# EAGLE design relays_board_v1_0 (EAGLE 6.4)
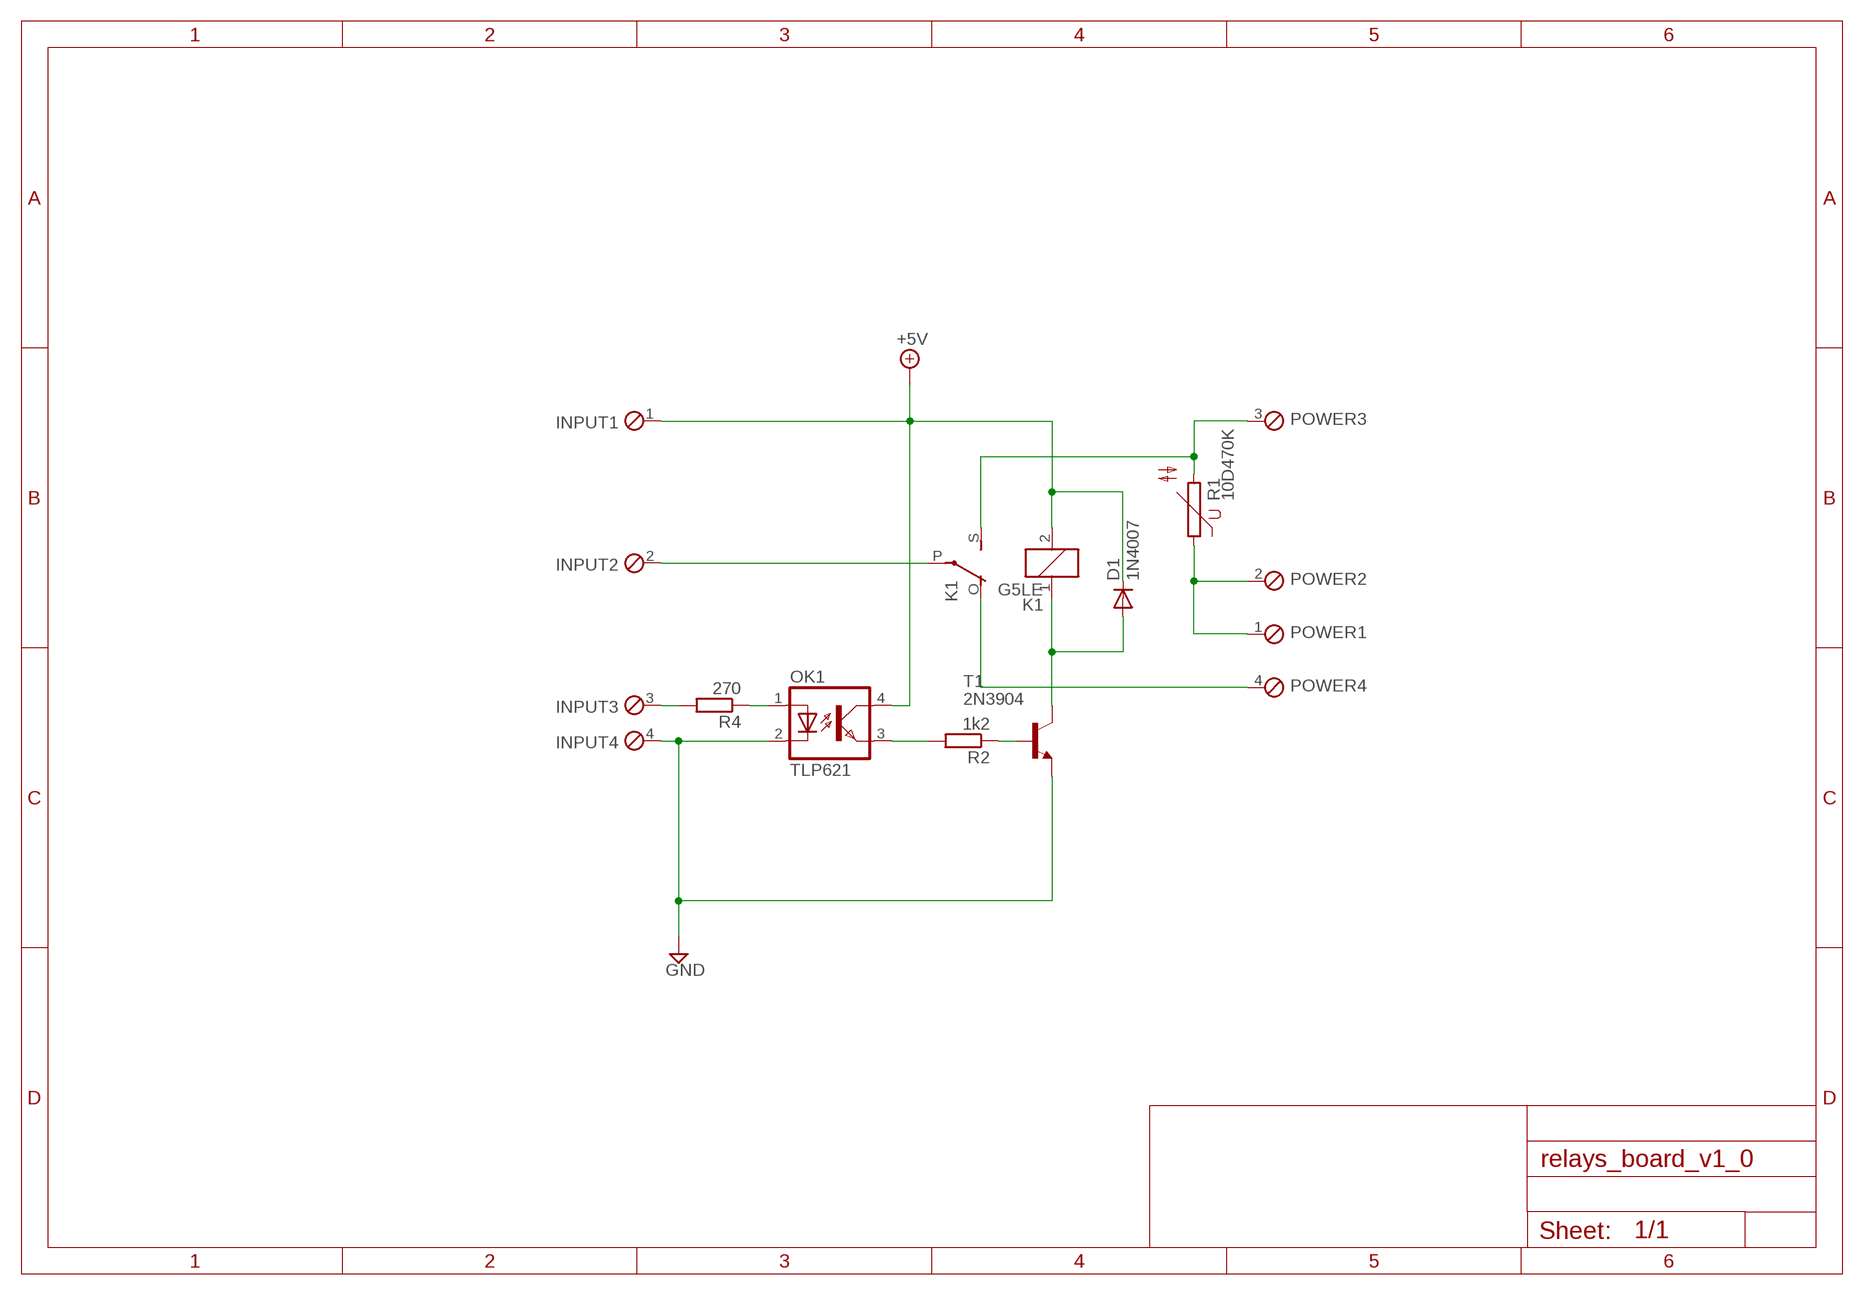
[diagram p0: schematic, sheet 1]

## Parts
D1  1N4007  [DO41-10]
INPUT  OSTTA040161  [040161]
K1  G5LE  [G5LE]
OK1  TLP621  [DIL04]
POWER  OSTTA040161  [040161]
R1  10D470K  [10D470K]
R2  1k2  R-EU_0204/7  [0204/7]
R4  270  R-EU_0204/7  [0204/7]
T1  2N3904  [TO92]

## Nets
+5V: D1.C INPUT.1 K1.2 OK1.4(COL)
GND: INPUT.4 OK1.2(C) T1.3(E)
N$1: K1.O(2:O) POWER.4
N$2: K1.S(2:S) POWER.3 R1.2
N$3: POWER.1 POWER.2 R1.1
N$4: INPUT.2 K1.P(2:P)
N$5: D1.A K1.1 T1.1(C)
N$6: INPUT.3 R4.2
N$7: OK1.1(A) R4.1
N$9: R2.1 T1.2(B)
N$10: OK1.3(EMIT) R2.2

## Library data of the parts
D1 = alex:1N4007: DIODE general purpose rectifier, 1 A
INPUT POWER = alex:OSTTA040161: OSTTA040161 4-pol Reihenklemme (Schraub) 5mm
K1 = relay:G5LE: RELAY 1 x switch, 10 A/120 V AC, 8 A/30 V DC, Omron; OC_FARNELL: unknown; OC_NEWARK: unknown
OK1 = alex:TLP621: TEXAS INSTRUMENTS OPTO COUPLER; OC_FARNELL: 1683363; OC_NEWARK: unknown
R1 = alex:10D470K: VARISTOR
R2 R4 = rcl:R-EU_: RESISTOR, European symbol
T1 = transistor:2N3904: NPN TRANSISTOR

## Board
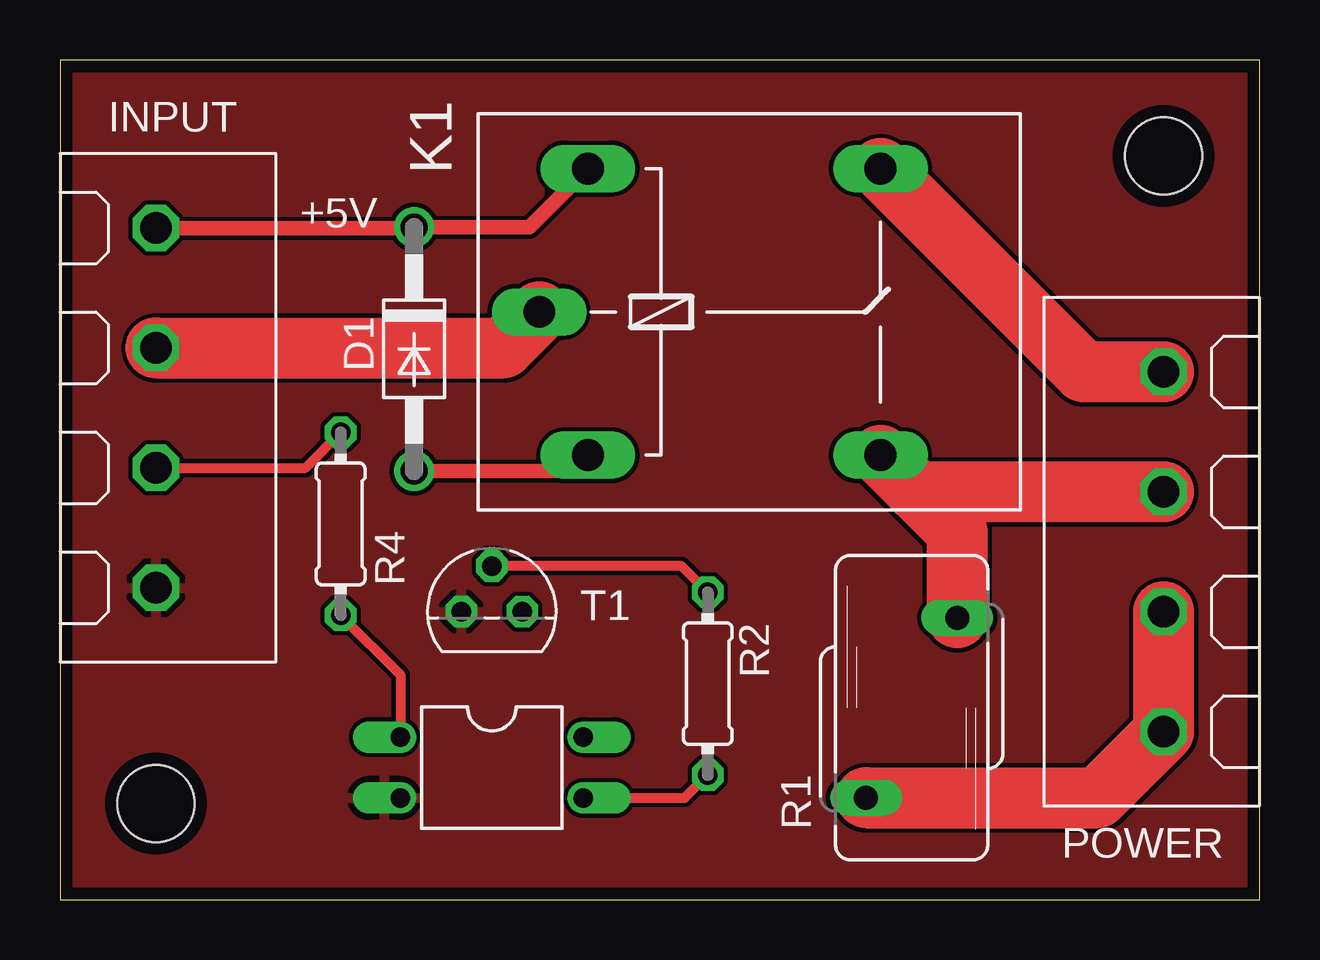
[diagram p1: board, top side]
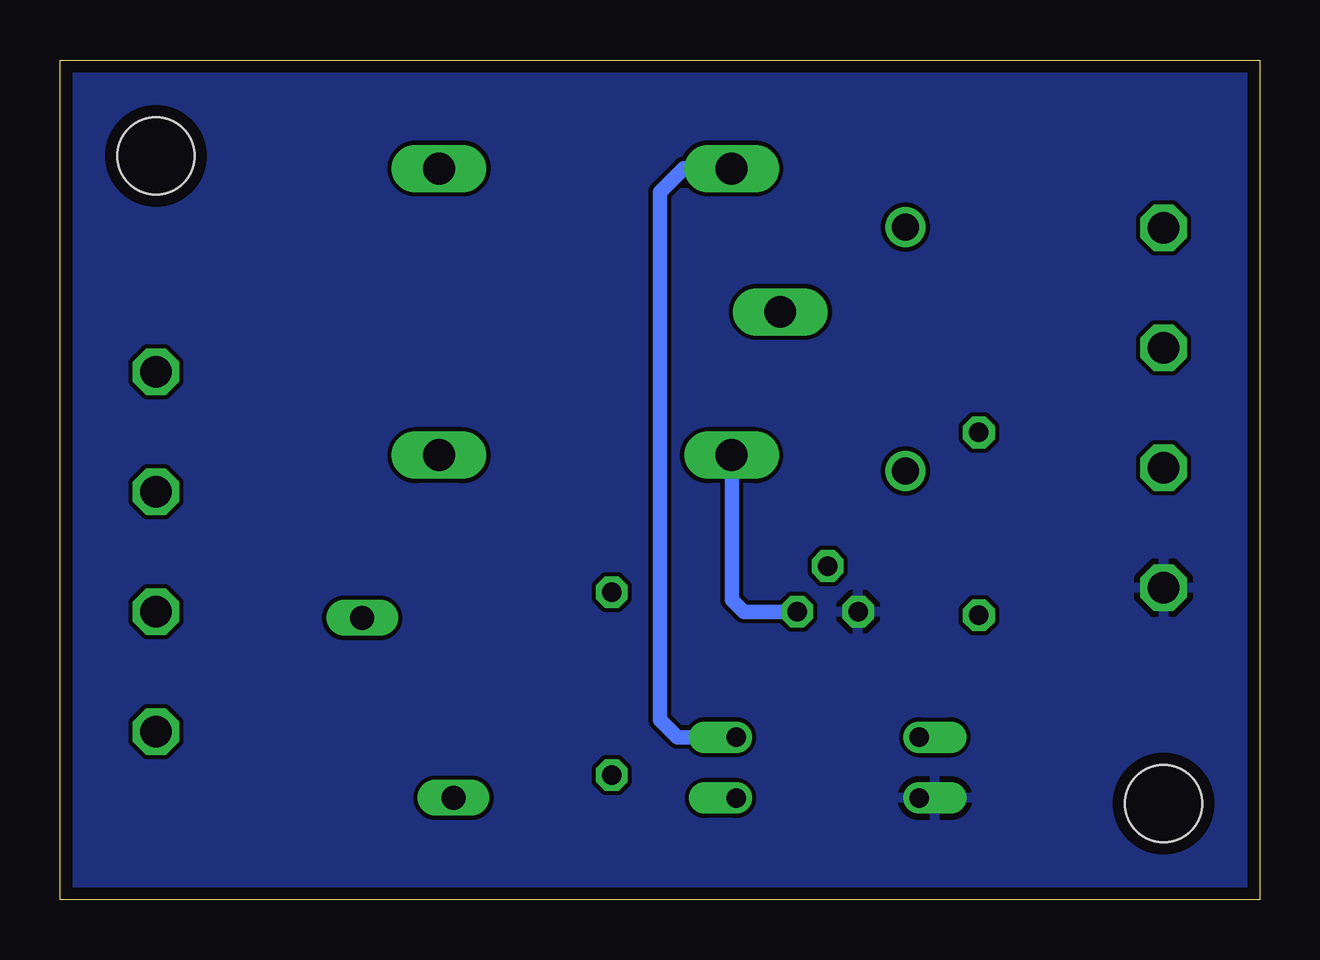
[diagram p2: board, bottom side, seen from below]

Size 50 x 35 mm. Coordinates in mm from the lower left corner, seen from the top.
Outline: 0,0 50,0 50,35 0,35 0,0
Copper layers (1*16): Top 0.035mm / dielectric 1.5mm / Bottom 0.035mm
Design rules "ShenZhen2U EagleRules": minimum track width 7mil, minimum drill 12mil, track to track 7mil, track to pad 7mil, pad to pad 7mil, via to via 7mil, smd to smd 0mil, copper to edge 20mil, drill to drill 10mil, minimum pad ring 10mil, minimum via ring 6mil, stop-mask expansion 2mil, vias tented up to drill 25mil, thermal gap 10mil
Holes 3.2 mm at 46,31 4,4

### Footprints (pad centres in the part's own frame; a part is rotated, then mirrored left to right if it is on the bottom)
DO41-10 = drill 1.118: A 5.08,0; C -5.08,0
040161 = drill 1.3 octagon: 1 -7.5,0; 2 -2.5,0; 3 2.5,0; 4 7.5,0
G5LE = drill 1.321 long: 1 -7.493,-5.969; 2 -7.493,5.969; O 4.699,5.969; P -9.525,0; S 4.699,-5.969
DIL04 = drill 0.813 offset: 1 -1.27,-3.81; 2 1.27,-3.81; 3 1.27,3.81; 4 -1.27,3.81
10D470K = drill 1 long: 1 -1.9,-3.75; 2 1.9,3.75
0204/7 = drill 0.813 octagon: 1 -3.81,0; 2 3.81,0
TO92 = drill 0.813 octagon: 1 1.27,0; 2 0,1.905; 3 -1.27,0

### Placement (x,y rotation side)
D1  14.76,22.95 270 top
INPUT  4,20.5 270 top
K1  29.5,24.5 0 top
OK1  18,5.5 270 top
POWER  46,14.5 90 top
R1  35.5,8 0 top
R2  27,9 270 top
R4  11.7,15.66 90 top
T1  18,12 0 top

### Tracks (layer width: path | path; a pad name or v marks a point on that pad's centre or on a via)
+5V
  Top 0.61: K1.2 19.57,28.03 D1.C 14.73,28 INPUT.1
  Bottom 0.61: OK1.4 24.27,6.77 25,7.5 25,29.5 24,30.5 22.04,30.5 K1.2 21.52,29.98
GND
  pour Bottom: 0,35 50,35 50,0 0,0
  pour Top: 0,35 50,35 50,0 0,0
N$1
  Top 2.54: POWER.4 42.67,22 K1.O
N$2
  Top 2.54: POWER.3 35.73,17 | 35.73,17 K1.S | R1.2 37.4,15.33 35.73,17
N$3
  Top 2.54: R1.1 43.25,4.25 POWER.1 POWER.2
N$4
  Top 2.54: INPUT.2 18.48,23 K1.P
N$5
  Top 0.61: D1.A 21.35,17.87 K1.1
  Bottom 0.61: T1.1 21.5,12 22,12.5 K1.1
N$6
  Top 0.406: INPUT.3 10.23,18 R4.2
N$7
  Top 0.406: R4.1 14.19,9.36 OK1.1
N$9
  Top 0.406: R2.1 25.91,13.9 T1.2
N$10
  Top 0.406: OK1.3 26.04,4.23 R2.2

### Text on the board
tNames: +5V